# EAGLE design Zuino M UNO (EAGLE 8.4.1)
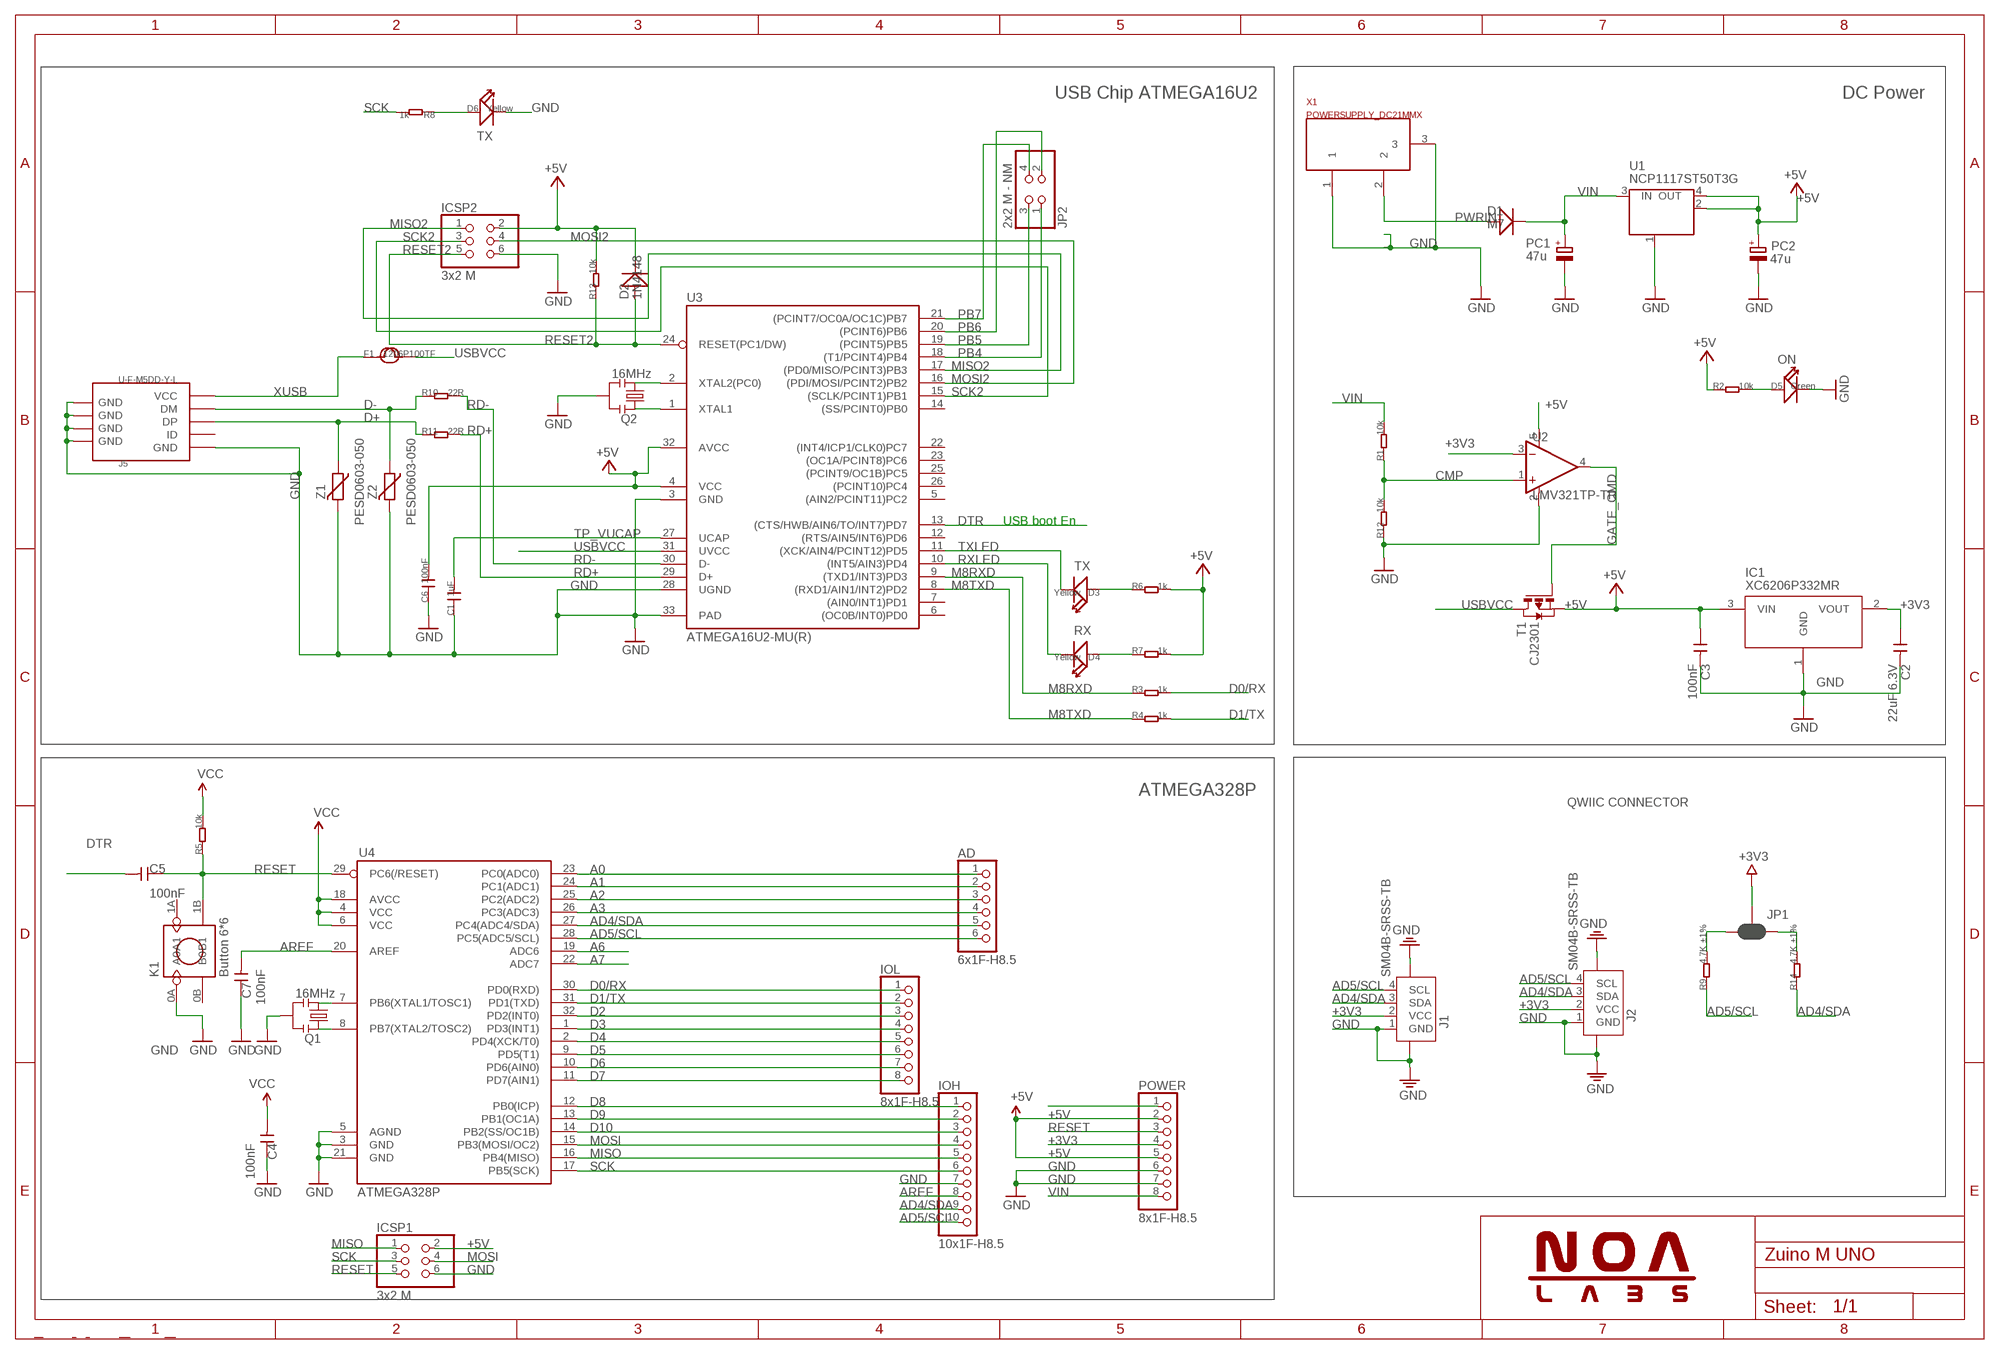
[diagram p0: schematic, sheet 1]

## Parts
AD  6x1F-H8.5  PINHD-1X6  [1X06]
C1  1uF  C-0603  [0603]
C2  22uF 6.3V  C-0603  [0603]
C3  100nF  C-0603  [0603]
C4  100nF  C-0603  [0603]
C5  100nF  C-0603  [0603]
C6  100nF  C-0603  [0603]
C7  100nF  C-0603  [0603]
D1  M7  D-B130L-13-F  [SMA]
D2  1N4148  D'1206'  [SOD123]
D3  Yellow  LED'0805'  [LED-0805]
D4  Yellow  LED'0805'  [LED-0805]
D5  Green  LED'0805'  [LED-0805]
D6  Yellow  LED'0805'  [LED-0805]
F1  1206P100TF  FUSE1206  [1206]
IC1  XC6206P332MR  XC6206MR  [SOT23]
ICSP1  3x2 M  PINHD-2X3  [2X03]
ICSP2  3x2 M  PINHD-2X3  [2X03]
IOH  10x1F-H8.5  PINHD-1X10_ARD  [1X10]
IOL  8x1F-H8.5  PINHD-1X8  [1X08]
J1  SM04B-SRSS-TB  JST-SH-4P-1.0  [JST-SH-4P]
J2  SM04B-SRSS-TB  JST-SH-4P-1.0  [JST-SH-4P]
J5  U-F-M5DD-Y-L  USB-MICROE  [MICRO-SMD]
JP1  JUMPER-SMT_3_2-NC_PASTE_SILK  [SMT-JUMPER_3_2-NC_PASTE_SILK]
JP2  2x2 M - NM  PINHD-2X2  [2X02]
K1  Button 6*6  BOTTON-4P-6X6  [4P-SMD-6X6]
PC1  47u  CPOL-EUD  [PANASONIC_D]
PC2  47u  CPOL-EUD  [PANASONIC_D]
POWER  8x1F-H8.5  PINHD-1X8  [1X08]
Q1  16MHz  RESONATORSMD  [RESONATOR-SMD]
Q2  16MHz  RESONATORSMD  [RESONATOR-SMD]
R1  10k  R-0603  [0603]
R2  10k  R-0603  [0603]
R3  1k  R-0603  [0603]
R4  1k  R-0603  [0603]
R5  10k  R-0603  [0603]
R6  1k  R-0603  [0603]
R7  1k  R-0603  [0603]
R8  1k  R-0603  [0603]
R9  4.7K ±1%  R-0603  [0603]
R10  22R  R-0603  [0603]
R11  22R  R-0603  [0603]
R12  10k  R-0603  [0603]
R13  10k  R-0603  [0603]
R14  4.7K ±1%  R-0603  [0603]
T1  CJ2301  PMOSSOT23  [SOT-23]
U1  NCP1117ST50T3G  MC33269ST-3.3T3  [SOT223]
U2  LMV321TP-TR  LM321  [SOT23-5]
U3  ATMEGA16U2-MU(R)  ATMEGA16U2-MU  [MLF32]
U4  ATMEGA328P  ATMEGA168  [TQFP32-08]
X1  POWERSUPPLY_DC21MMX  [POWERSUPPLY_DC-21MM]
Z1  PESD0603-050  VARISTORCN0603  [CT/CN0603]
Z2  PESD0603-050  VARISTORCN0603  [CT/CN0603]

## Nets
+3V3: C2.1 IC1.2(VOUT) J1.2(VCC) J2.2(VCC) JP1.2 POWER.4 U2.3(IN-)
+5V [usbvcc]: C3.1 C4.2 C6.2 D2.- IC1.3(VIN) ICSP1.2 ICSP2.2 PC2.+ POWER.2 POWER.5 R2.1 R5.2 R6.2 R7.2 R13.2 T1.2(S) U1.2(OUT) U1.4(OUT) U2.5(V+) U3.4(VCC) U3.32(AVCC) U4.4(VCC) U4.6(VCC) U4.18(AVCC) ; supply symbol labelled VCC
A0: AD.1 U4.23(PC0(ADC0))
A1: AD.2 U4.24(PC1(ADC1))
A2: AD.3 U4.25(PC2(ADC2))
A3: AD.4 U4.26(PC3(ADC3))
A6: U4.19(ADC6)
A7: U4.22(ADC7)
AD4/SDA: AD.5 IOH.9 J1.3(SDA) J2.3(SDA) R14.1 U4.27(PC4(ADC4/SDA))
AD5/SCL: AD.6 IOH.10 J1.4(SCL) J2.4(SCL) R9.1 U4.28(PC5(ADC5/SCL))
AREF [aref]: C7.2 IOH.8 U4.20(AREF)
CMP: R1.1 R12.2 U2.1(IN+)
D0/RX: IOL.1 R3.2 U4.30(PD0(RXD))
D1/TX: IOL.2 R4.2 U4.31(PD1(TXD))
D2: IOL.3 U4.32(PD2(INT0))
D3: IOL.4 U4.1(PD3(INT1))
D4: IOL.5 U4.2(PD4(XCK/T0))
D5: IOL.6 U4.9(PD5(T1))
D6: IOL.7 U4.10(PD6(AIN0))
D7: IOL.8 U4.11(PD7(AIN1))
D8: IOH.1 U4.12(PB0(ICP))
D9: IOH.2 U4.13(PB1(OC1A))
D10: IOH.3 U4.14(PB2(SS/OC1B))
D+: J5.D+(DP) R11.1 Z1.1
D-: J5.D-(DM) R10.1 Z2.1
DTR: C5.2 U3.13((CTS/HWB/AIN6/TO/INT7)PD7)
GATE_CMD: T1.3(G) U2.4(OUT)
GND [gnd]: C1.1 C2.2 C3.2 C4.1 C6.1 C7.1 D5.- D6.- IC1.1(GND) ICSP1.6 ICSP2.6 IOH.7 J1.1(GND) J1.NC1 J1.NC2 J2.1(GND) J2.NC1 J2.NC2 J5.GND J5.S1(GND) J5.S1@1(GND) J5.S1@2(GND) J5.S2(GND) J5.S2@1(GND) J5.S2@2(GND) J5.S3(GND) J5.S3@1(GND) J5.S3@2(GND) J5.S4(GND) J5.S4@1(GND) J5.S4@2(GND) K1.0A(A0) PC1.- PC2.- POWER.6 POWER.7 Q1.2 Q2.2 R12.1 U1.1(GND/ADJ) U2.2(V-) U3.3(GND) U3.28(UGND) U3.33(PAD) U4.3(GND) U4.5(AGND) U4.21(GND) X1.1 X1.3 Z1.2 Z2.2
M8RXD: R3.1 U3.9((TXD1/INT3)PD3)
M8TXD: R4.1 U3.8((RXD1/AIN1/INT2)PD2)
MISO: ICSP1.1 IOH.5 U4.16(PB4(MISO))
MISO2: ICSP2.1 U3.17((PD0/MISO/PCINT3)PB3)
MOSI: ICSP1.4 IOH.4 U4.15(PB3(MOSI/OC2))
MOSI2: ICSP2.4 U3.16((PDI/MOSI/PCINT2)PB2)
N$1: D6.+ R8.1
N$2: POWER.1
N$3: D5.+ R2.2
N$5: Q2.1 U3.1(XTAL1)
N$9: JP1.3 R9.2
N$10: JP1.1 R14.2
N$16: Q1.1 U4.8(PB7(XTAL2/TOSC2))
N$17: Q1.3 U4.7(PB6(XTAL1/TOSC1))
N$21: Q2.3 U3.2(XTAL2(PC0))
N$35: D4.+ R7.1
N$36: D3.+ R6.1
PB4: JP2.1 U3.18((T1/PCINT4)PB4)
PB5: JP2.3 U3.19((PCINT5)PB5)
PB6: JP2.2 U3.20((PCINT6)PB6)
PB7: JP2.4 U3.21((PCINT7/OC0A/OC1C)PB7)
PWRIN [power]: D1.P$2(+) X1.2
RD+: R11.2 U3.29(D+)
RD-: R10.2 U3.30(D-)
RESET: C5.1 ICSP1.5 K1.1B(B1) POWER.3 R5.1 U4.29(PC6(/RESET))
RESET2: D2.+ ICSP2.5 R13.1 U3.24(RESET(PC1/DW))
RXLED: D4.- U3.10((INT5/AIN3)PD4)
SCK: ICSP1.3 IOH.6 R8.2 U4.17(PB5(SCK))
SCK2: ICSP2.3 U3.15((SCLK/PCINT1)PB1)
TP_VUCAP: C1.2 U3.27(UCAP)
TXLED: D3.- U3.11((XCK/AIN4/PCINT12)PD5)
USBVCC [usbvcc]: F1.2 T1.1(D) U3.31(UVCC)
VIN [power]: D1.P$1(-) PC1.+ POWER.8 R1.2 U1.3(IN)
XUSB [usbvcc]: F1.1 J5.VBUS(VCC)
Unconnected: J5.ID K1.0B(B0) K1.1A(A1) U3.5((AIN2/PCINT11)PC2) U3.6((OC0B/INT0)PD0) U3.7((AIN0/INT1)PD1) U3.12((RTS/AIN5/INT6)PD6) U3.14((SS/PCINT0)PB0) U3.22((INT4/ICP1/CLK0)PC7) U3.23((OC1A/PCINT8)PC6) U3.25((PCINT9/OC1B)PC5) U3.26((PCINT10)PC4)

## Notes on the sheet
- USB Chip ATMEGA16U2 | DC Power
- TX
- ON
- USB boot En
- TX
- RX
- ATMEGA328P
- QWIIC CONNECTOR

## Library data of the parts
AD = SmartPrj:PINHD-1X6: PIN HEADER
C1-C7 = Discrete:C*: Ceramic Capacitors
D1 D2 = Discrete:D*
D3-D6 = Discrete:LED*
F1 = Discrete:FUSE
IC1 = IC:XC6206MR
ICSP1 ICSP2 = SmartPrj:PINHD-2X3: PIN HEADER
IOH = SmartPrj:PINHD-1X10_ARD: PIN HEADER
IOL POWER = SmartPrj:PINHD-1X8: PIN HEADER
J1 J2 = Connector:JST-SH-4P
J5 = Connector:USB-MICROE
JP1 = SparkFun-Jumpers:JUMPER-SMT_3_2-NC_PASTE: Normally closed solder jumper (2 of 2 connections) This jumper has an aperture in the stencil to allow solder paste to bridge both connections. Both connections are normally closed (NC). Wick off the solder to open the connection(s). Reapply solder to reclose the connection(s).
JP2 = SmartPrj:PINHD-2X2: PIN HEADER
K1 = Discrete:BOTTON-4P
PC1 PC2 = rcl:CPOL-EU: POLARIZED CAPACITOR, European symbol
Q1 Q2 = SparkFun:RESONATOR: Resonator Small SMD resonator. This is the itty bitty 10/20MHz resonators with built in caps. CSTCE10M0G55 and CSTCE20M0V53. Footprint has been reviewed closely but hasn't been tested yet.
R1-R8 R10-R13 = Discrete:R*
R9 R14 = Discretex:R*
T1 = zetex:PMOSSOT23: MOS FET
U1 = linear:MC33269ST*: Adjustable Output Low Dropout Voltage Regulator 800 mA Source: http://www.onsemi.com/pub/Collateral/MC33269-D.PDF
U2 = IC:LM321: Low Power Single Op Amp http://www.national.com/ds/LM/LM321.pdf
U3 = SmartPrj:ATMEGA16U2-
U4 = SparkFun:ATMEGA168
X1 = SmartPrj:POWERSUPPLY_DC21MM
Z1 Z2 = varistor:VARISTOR: VARISTOR

## Net classes
1 power: width 0.254 mm, drill 0.381 mm, clearance 0.178 mm
2 gnd: width 0.254 mm, drill 0.305 mm, clearance 0.178 mm
3 usbvcc: width 0.254 mm, drill 0.381 mm, clearance 0.178 mm
4 aref: width 0.254 mm, drill 0.381 mm, clearance 0.178 mm

## Board
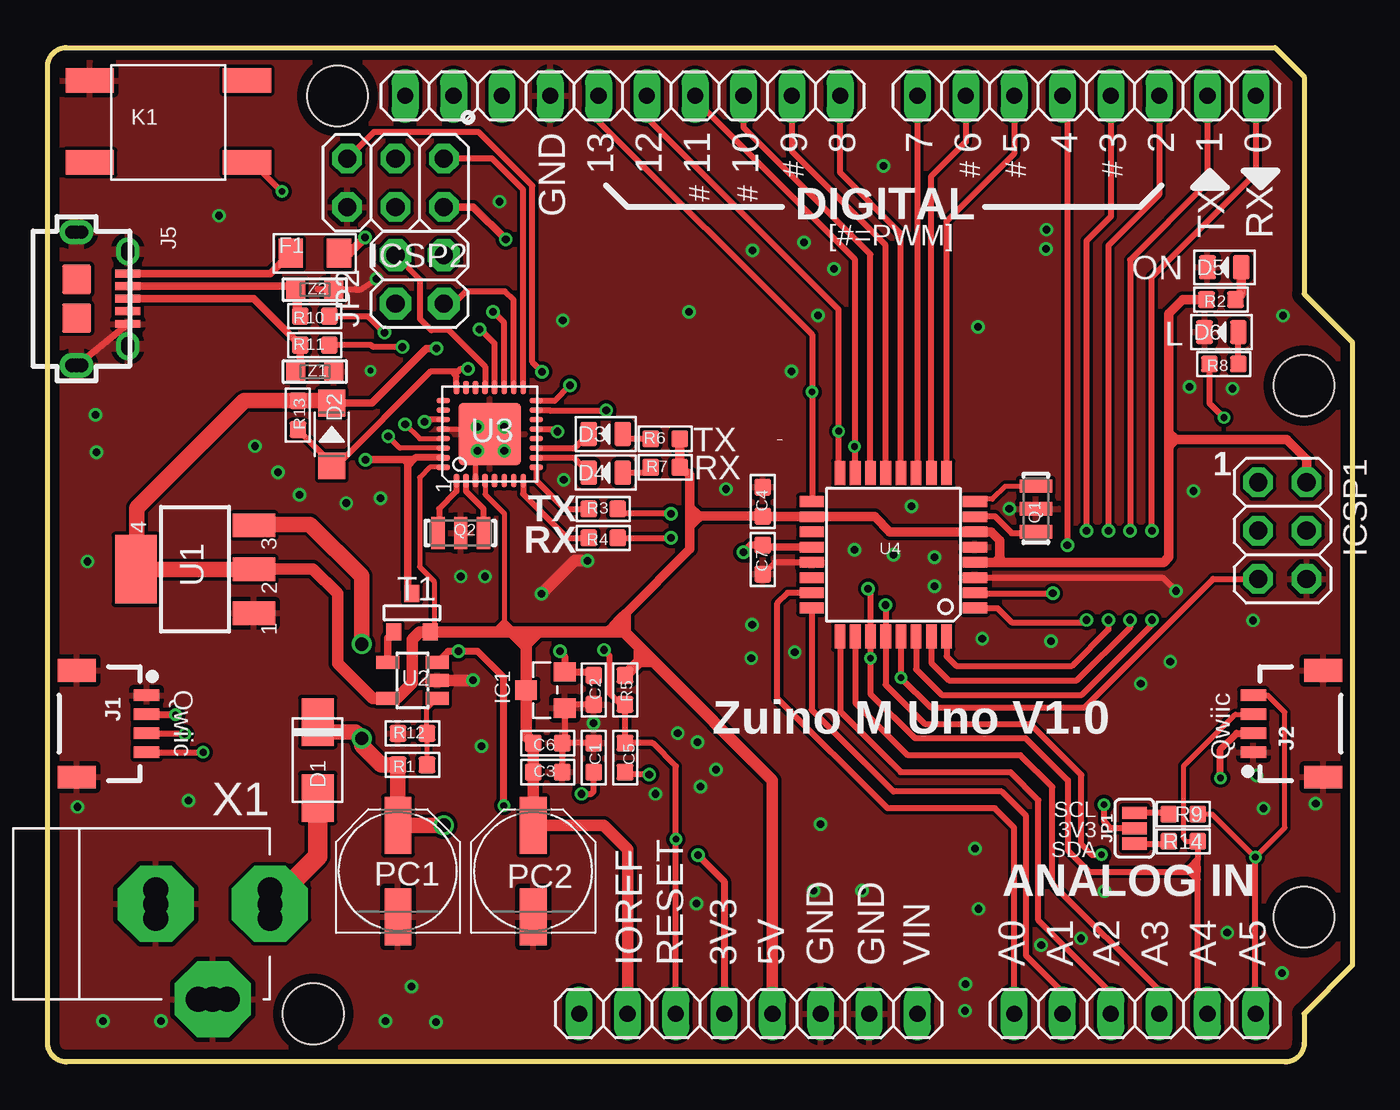
[diagram p1: board, top side]
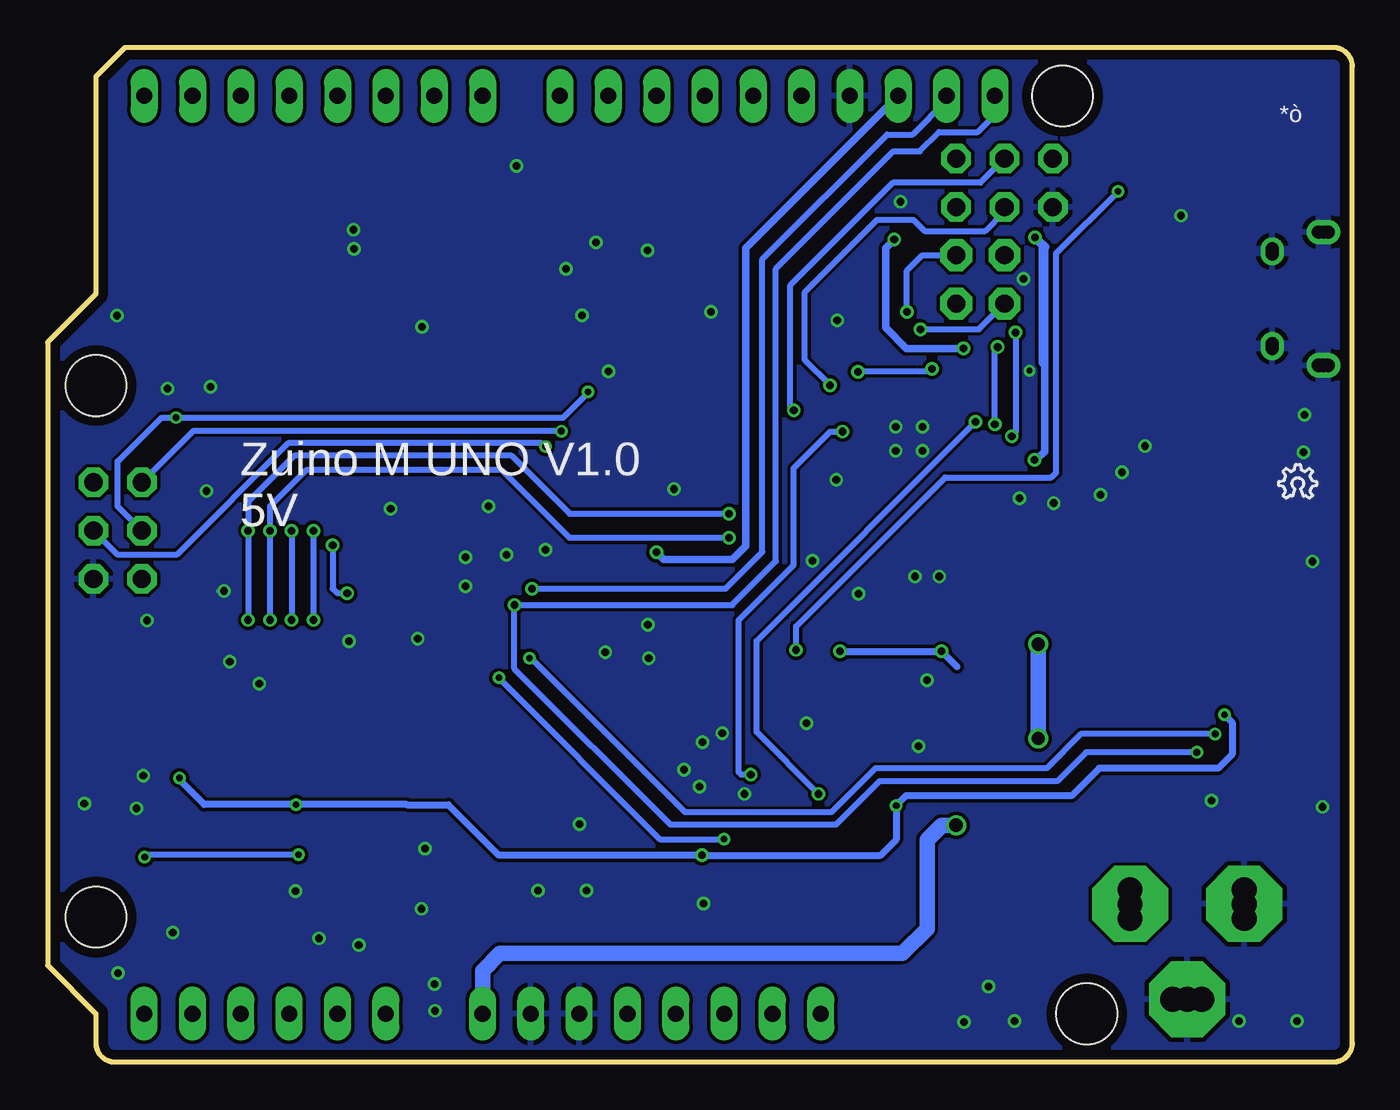
[diagram p2: board, bottom side, seen from below]

Size 68.58 x 53.34 mm. Coordinates in mm from the lower left corner, seen from the top.
Outline: 64.52,53.34 66.04,51.82 66.04,40.39 68.58,37.85 68.58,5.08 66.04,2.54 66.04,1 arc-90 65.04,0 1,0 arc-90 0,1 0,52.34 arc-90 1,53.34 64.52,53.34
Copper layers (1*16): Top 0.035mm / dielectric 1.5mm / Bottom 0.035mm
Design rules "NOA Eagle Rule": minimum track width 7mil, minimum drill 12mil, track to track 7mil, track to pad 7mil, pad to pad 7mil, via to via 7mil, smd to smd 0mil, copper to edge 20mil, drill to drill 10mil, minimum pad ring 10mil, minimum via ring 6mil, stop-mask expansion 2mil, vias tented up to drill 25mil, thermal gap 10mil
Holes 3.2 mm at 66.04,35.56 66.04,7.62 15.24,50.8 13.97,2.54

### Footprints (pad centres in the part's own frame; a part is rotated, then mirrored left to right if it is on the bottom)
1X06 = drill 0.85 pad 1.422 long: 1 -6.35,0; 2 -3.81,0; 3 -1.27,0; 4 1.27,0; 5 3.81,0; 6 6.35,0
0603 = smd 0.889 x 0.889: 1 -0.762,0; 2 0.762,0
SMA = smd 2.5 x 1.7: P$1 -2,0; P$2 2,0
SOD123 = smd 1.397 x 1.397: + 1.651,0; - -1.651,0
LED-0805 = smd 0.889 x 1.27: + -0.889,0; - 0.889,0
1206 = smd 1.27 x 1.524: 1 -1.27,0; 2 1.27,0
SOT23 = smd 1.016 x 1.143: 1 -0.95,-1.016; 2 0.95,-1.016; 3 0,1.016
2X03 = drill 0.95 pad 1.55 octagon: 1 -2.54,-1.27; 2 -2.54,1.27; 3 0,-1.27; 4 0,1.27; 5 2.54,-1.27; 6 2.54,1.27
1X10 = drill 0.85 pad 1.422 long: 1 -11.43,0; 2 -8.89,0; 3 -6.35,0; 4 -3.81,0; 5 -1.27,0; 6 1.27,0; 7 3.81,0; 8 6.35,0; 9 8.89,0; 10 11.43,0
1X08 = drill 0.85 pad 1.422 long: 1 -8.89,0; 2 -6.35,0; 3 -3.81,0; 4 -1.27,0; 5 1.27,0; 6 3.81,0; 7 6.35,0; 8 8.89,0
JST-SH-4P = smd 0.6 x 1.35: 1 1.5,0; 2 0.5,0; 3 -0.5,0; 4 -1.5,0 | smd 1.2 x 2: NC1 -2.8,3.675; NC2 2.8,3.675
MICRO-SMD = smd 0.406 x 1.346: D+ 0,2.057; D- -0.66,2.057; GND 1.321,2.057; ID 0.66,2.057; VBUS -1.321,2.057 | drill 0.7: S1 -2.489,2.057; S1@1 -2.616,2.057; S1@2 -2.362,2.057; S2 2.464,2.057; S2@1 2.362,2.057; S2@2 2.616,2.057 | drill 0.7 pad 1.27: S3 -3.505,-0.66; S3@1 -3.505,-0.381; S3@2 -3.505,-0.889; S4 3.505,-0.635; S4@1 3.505,-0.381; S4@2 3.505,-0.889 | smd 1.524 x 1.524: S5 -1.016,-0.635; S6 1.016,-0.635
SMT-JUMPER_3_2-NC_PASTE_SILK = smd 0.635 x 1.27: 1 -0.813,0; 2 0,0; 3 0.813,0
2X02 = drill 0.95 pad 1.676 octagon: 1 -1.27,-1.27; 2 -1.27,1.27; 3 1.27,-1.27; 4 1.27,1.27
4P-SMD-6X6 = smd 2.54 x 1.27: 0A -4.129,2.205; 0B 4.129,2.205; 1A -4.129,-2.105; 1B 4.129,-2.105
PANASONIC_D = smd 3 x 1.4: + 2.4,0; - -2.4,0
RESONATOR-SMD = smd 0.7 x 1.7: 1 -1.2,0; 2 0,0; 3 1.2,0
SOT-23 = smd 0.787 x 0.889: 1 0.025,-1.016; 2 -0.94,1.016; 3 0.991,1.016
SOT223 = smd 1.219 x 2.235: 1 -2.311,-3.099; 2 0,-3.099; 3 2.311,-3.099 | smd 3.6 x 2.2: 4 0,3.099
SOT23-5 = smd 0.69 x 1.2: 1 -0.95,-1.3; 2 0,-1.3; 3 0.95,-1.3; 4 0.95,1.3; 5 -0.95,1.3
MLF32 = smd 0.7 x 0.28: 1 -2.45,1.75; 2 -2.45,1.25; 3 -2.45,0.75; 4 -2.45,0.25; 5 -2.45,-0.25; 6 -2.45,-0.75; 7 -2.45,-1.25; 8 -2.45,-1.75; 17 2.45,-1.75; 18 2.45,-1.25; 19 2.45,-0.75; 20 2.45,-0.25; 21 2.45,0.25; 22 2.45,0.75; 23 2.45,1.25; 24 2.45,1.75 | smd 0.28 x 0.7: 9 -1.75,-2.45; 10 -1.25,-2.45; 11 -0.75,-2.45; 12 -0.25,-2.45; 13 0.25,-2.45; 14 0.75,-2.45; 15 1.25,-2.45; 16 1.75,-2.45; 25 1.75,2.45; 26 1.25,2.45; 27 0.75,2.45; 28 0.25,2.45; 29 -0.25,2.45; 30 -0.75,2.45; 31 -1.25,2.45; 32 -1.75,2.45 | smd 3.254 x 3.254: 33 0,0
TQFP32-08 = smd 1.27 x 0.559: 1 -4.293,2.8; 2 -4.293,2; 3 -4.293,1.2; 4 -4.293,0.4; 5 -4.293,-0.4; 6 -4.293,-1.2; 7 -4.293,-2; 8 -4.293,-2.8; 17 4.293,-2.8; 18 4.293,-2; 19 4.293,-1.2; 20 4.293,-0.4; 21 4.293,0.4; 22 4.293,1.2; 23 4.293,2; 24 4.293,2.8 | smd 0.559 x 1.27: 9 -2.8,-4.293; 10 -2,-4.293; 11 -1.2,-4.293; 12 -0.4,-4.293; 13 0.4,-4.293; 14 1.2,-4.293; 15 2,-4.293; 16 2.8,-4.293; 25 2.8,4.293; 26 2,4.293; 27 1.2,4.293; 28 0.4,4.293; 29 -0.4,4.293; 30 -1.2,4.293; 31 -2,4.293; 32 -2.8,4.293
POWERSUPPLY_DC-21MM = drill 1.3 pad 4 octagon: 1 -5.08,-3.353; 2 -0.076,-6.35; 3 -0.076,-0.356 | drill 1.3: 4 -5.08,-4.115; 5 -5.08,-2.591; 6 -0.838,-0.356; 7 0.686,-0.356; 8 -0.838,-6.35; 9 0.686,-6.35
CT/CN0603 = smd 1 x 1: 1 -1,0; 2 1,0

### Placement (x,y rotation side)
AD  57.15,2.54 0 top
C1  28.7,16 270 top
C2  28.7,19.56 270 top
C3  26.29,15.24 0 top
C4  37.59,29.46 270 top
C5  30.35,16 270 top
C6  26.29,16.76 180 top
C7  37.59,26.42 90 top
D1  14.2,15.88 270 top
D2  14.94,32.99 270 top
D3  29.34,33.02 180 top
D4  29.34,30.99 180 top
D5  61.85,41.78 180 top
D6  61.7,38.38 180 top
E$13  [12MM]  40.16,40.94 0 bottom
F1  14.05,42.52 0 top
IC1  26.16,19.56 90 top
ICSP1  64.9,27.94 270 top
ICSP2  18.29,46.23 180 top
IOH  30.23,50.8 180 top
IOL  54.61,50.8 180 top
J1  5.21,17.78 90 top
J2  63.37,17.78 270 top
J5  2.16,40.13 270 top
JP1  57.12,12.29 90 top
JP2  19.56,41.15 90 top
K1  6.35,49.4 0 top
LOGO1  LOGO-OSHW-6MILX0070-NT  [OSHW_6X70_NOTEXT]  3.86,29.64 0 bottom
PC1  18.41,10.03 90 top
PC2  25.53,10.03 90 top
POWER  36.83,2.54 0 top
Q1  51.94,29.08 270 top
Q2  21.72,27.81 0 top
R1  19.18,15.62 180 top
R2  61.67,40.08 0 top
R3  29.21,29.08 0 top
R4  29.21,27.56 0 top
R5  30.35,19.56 90 top
R6  32.46,32.77 0 top
R7  32.46,31.27 0 top
R8  61.82,36.7 180 top
R9  59.69,13.03 180 top
R10  14.05,39.22 0 top
R11  14.05,37.69 0 top
R12  19.18,17.27 0 top
R13  13.16,34.01 90 top
R14  59.69,11.61 180 top
T1  19.18,23.62 180 top
U1  7.75,25.91 90 top
U2  19.18,20.07 90 top
U3  23.24,33.02 90 top
U4  44.45,26.67 180 top
U$1  [10MM]  40.56,34.19 0 top
X1  5.33,8.38 90 top
Z1  14.05,36.3 0 top
Z2  14.05,40.61 0 top

### Tracks (layer width: path | path; a pad name or v marks a point on that pad's centre or on a via)
+3V3  (via drill 0.35, 0.4)
  Top 0.305: JP1.2 55.88,12.29 55.52,12.65 v55.52,13.54
  Top 0.381: v26.92,21.59 27.18,21.34 IC1.2 28.51,20.51 C2.1 | U2.3 21.05,21.59 v21.59,21.59 22.61,21.59 23.98,20.22 v23.98,13.49 | v34.19,10.87 35.56,9.5 POWER.4 | v61.65,14.94 61.65,16.43 62.49,17.28 J2.2 | J1.2 6.71,18.28 v6.73,18.26
  Bottom 0.381: v26.92,21.59 v21.59,21.59 20.78,20.78 | v61.65,14.94 61.65,14.83 60.35,13.54 v55.52,13.54 49.71,13.54 49.7,13.53 47.51,13.53 44.86,10.87 v34.19,10.87 24.79,10.87 23.98,11.68 v23.98,13.49 23.47,13.99 14.76,13.99 13.31,15.44 7.06,15.44 6.33,16.18 6.33,17.86 v6.73,18.26
+5V  (via drill 0.4)
  Top 0.254: U3.32 20.09,31.27 19.56,30.73 19.56,26.04 20.32,25.27 20.32,22.81 T1.2 | U3.4 22.99,29.84 24,28.83 24,23.16 | 24,23.16 24,22.73 23.88,22.61 | 24,23.16 23.44,22.61 | 24,23.16 24.56,22.61
  Top 0.305: 49.66,26.27 49.69,26.27 50.04,26.62 50.39,26.27 50.52,26.27
  Top 0.406: v20.45,37.52 19.91,37.52 17.04,34.65 D2.- | v24.08,43.26 22.38,44.96 ICSP2.2
  Top 0.508: R6.2 R7.2 33.76,30.89 33.76,29.16 | U4.4 49.66,26.27 50.04,26.27 | 50.04,26.27 50.52,26.27 58.66,26.27 58.93,26.54 58.93,32.44 | 50.04,26.27 50.04,26.62 50.04,27.43 49.6,27.87 U4.6 44.27,27.87 43.47,28.67 U4.18 37.62,28.67 C4.2 34.19,28.7 | 33.76,29.16 33.76,28.63 | 33.76,28.17 33.76,28.63 | 33.76,28.17 33.76,26.98 30.4,23.62 | 30.4,23.62 30.12,23.34 | 30.4,23.62 30.4,22.71 30.3,22.61 | 30.12,23.34 30.12,22.89 29.84,22.61 | 30.12,23.34 29.72,22.94 29.72,22.91 | 29.72,22.91 29.72,22.61 | 29.72,22.91 29.41,22.61 | 58.93,32.72 58.93,33.07 | 58.93,32.44 58.93,32.72 | 58.93,32.72 59.28,32.72 | 59.28,32.72 65.13,32.72 66.17,31.67 ICSP1.2 | 59.28,32.72 58.93,33.07 | 59.28,32.72 59,32.44 58.93,32.44 | 33.76,28.63 33.83,28.7 34.19,28.7 | 34.19,28.7 34.19,28.73 33.76,29.16 | 34.19,28.7 34.19,28.6 33.76,28.17 | R2.1 59.66,40.08 58.93,39.34 58.93,33.07
  Top 0.61: 25.15,21.84 IC1.3 25.15,17.14 C6.2 C3.1 PC2.+ 29.22,12.43 30.48,11.18 POWER.2 | 24.38,22.61 25.15,21.84 | 24.38,22.61 23.88,22.61 23.44,22.61 T1.2 19.56,22.61 19.18,22.23 19.18,19.94 18.35,19.12 U2.5 17.08,19.12 15.24,20.95 15.24,24.64 13.95,25.93 10.87,25.93 U1.2 | 25.15,21.84 25.15,21.97 25.78,22.61 | 25.78,22.61 29.41,22.61 29.72,22.61 29.84,22.61 30.3,22.61 31.23,21.68 | POWER.5 38.1,14.81 31.93,20.98 | 25.78,22.61 24.56,22.61 24.38,22.61 | 31.23,21.68 31.51,21.4 | 31.93,20.98 31.51,21.4 | R5.2 31.1,21.07 | 31.1,21.07 31.43,21.4 31.51,21.4 | 31.1,21.07 31.84,21.07 31.93,20.98 | 31.1,21.07 31.1,21.55 31.23,21.68
  Top 0.813: 13.13,34.75 R13.2 | R13.2 10.34,34.77 4.7,29.13 4.7,25.96 U1.4 U1.2 | R13.2 14.81,34.77 D2.-
  Bottom 0.406: v20.45,37.52 23.44,37.52 24.54,38.61 24.54,42.8 v24.08,43.26
A0
  Top 0.305: U4.23 38.89,24.67 38.35,24.13 38.35,19.13 44.15,13.34 49.78,13.34 50.8,12.32 AD.1
A1
  Top 0.305: U4.24 40.16,18.52 44.45,14.22 50.14,14.22 51.44,12.93 51.44,5.59 53.34,3.68 AD.2
A2
  Top 0.305: U4.25 41.65,18.42 44.83,15.24 50.6,15.24 52.07,13.77 52.07,7.44 55.85,3.66 55.85,2.56 AD.3
A3
  Top 0.305: U4.26 42.45,18.89 45.21,16.13 51.13,16.13 52.81,14.45 52.81,9.37 58.42,3.76 AD.4
AD4/SDA  (via drill 0.35, 0.4)
  Top 0.254: R14.1 59.84,11.61 59.7,11.75 59.7,15.56 62.42,18.28 J2.3
  Top 0.305: v43.13,24.89 43.25,24.77 U4.27 v43.25,21.23 43.25,19.36 45.59,17.02 51.41,17.02 53.62,14.81 53.62,11.12 54.74,10.01 59.79,10.01 | 60.45,10.67 60.02,10.24 | 59.89,10.11 59.79,10.01 | 60.45,9.6 60.45,10.01 | 60.45,9.6 60.45,3.05 AD.5 | 60.45,10.24 60.45,10.01 | 60.45,10.24 60.45,10.67 | 59.79,10.01 60.45,10.01 | 59.89,10.11 60.02,10.24 | 60.02,10.24 60.45,10.24 | 59.89,10.11 60.4,9.6 60.45,9.6 | R14.1 60.45,10.67 | J1.3 7.18,17.28 v7.21,17.25
  Bottom 0.305: v43.13,24.89 32.94,24.89 31.01,26.82 31.01,42.22 24.46,48.77 23.11,48.77 21.34,50.55 IOH.9 | v7.21,17.25 14.28,17.25 16.08,15.44 25.07,15.44 27.38,13.13 35.08,13.13 42.98,21.03 | 42.98,21.03 43.08,21.13 | v43.25,21.23 43.18,21.23 42.98,21.03
AD5/SCL  (via drill 0.35, 0.4)
  Top 0.254: 60.55,13.03 61.21,13.03 v63.48,10.77 65.02,12.32 65.02,18.39 64.13,19.28 J2.4
  Top 0.305: 44.05,23.75 U4.28 44.05,19.83 46.1,17.78 51.64,17.78 54.33,15.09 54.33,11.43 54.86,10.9 v55.4,10.9 | 44.05,23.75 44.05,24.05 | v44.04,24.03 44.04,23.75 44.05,23.75 | 63.5,2.77 AD.6 63.48,2.56 v63.48,10.77 | R9.1 60.55,13.03 | J1.4 v8.18,16.28
  Bottom 0.305: IOH.10 18.8,49.78 19.68,48.9 21.72,48.9 22.73,47.88 24.13,47.88 30.3,41.71 30.3,26.34 32.59,24.05 32.59,24.03 v44.04,24.03 44.04,20.68 35.84,12.47 27.15,12.47 24.87,14.76 15.52,14.76 13.99,16.28 v8.18,16.28 | v63.48,10.77 63.35,10.9 v55.4,10.9
AREF  (via drill 0.4)
  Top 0.406: 38.3,27.07 U4.20 | 38.3,27.07 37.48,27.07 37.47,27.05 | v36.58,26.8 36.96,27.18 C7.2 37.7,27.07 38.3,27.07
  Bottom 0.406: v36.58,26.8 36.2,26.42 32.59,26.42 31.88,27.13 31.88,42.8 IOH.8
CMP
  Top 0.254: R1.1 R12.2 19.94,18.58 U2.1
D0/RX  (via drill 0.4)
  Top 0.305: U4.30 45.65,20.64 46.99,19.3 54.36,19.3 58.04,22.99 v58.04,23.24 | v32.77,28.83 30.23,28.83 R3.2 | v58.04,27.94 58.04,41.27 63.5,46.74 IOL.1
  Bottom 0.305: v32.77,28.83 41.15,28.83 44.2,31.88 55.63,31.88 58.04,29.46 v58.04,27.94 v58.04,23.24
D1/TX  (via drill 0.4)
  Top 0.305: U4.31 46.45,20.99 47.37,20.07 54.1,20.07 56.9,22.86 v56.9,23.24 | R4.2 v32.77,27.56 | v56.9,27.94 56.9,42.16 60.96,46.23 IOL.2
  Bottom 0.305: v32.77,27.56 41.15,27.56 44.7,31.11 54.99,31.11 56.9,29.21 v56.9,27.94 v56.9,23.24
D2  (via drill 0.4)
  Top 0.305: U4.32 47.25,21.33 47.75,20.83 53.85,20.83 55.75,22.73 v55.75,23.24 | v55.75,27.94 55.75,42.93 58.42,45.59 IOL.3
  Bottom 0.305: v55.75,27.94 v55.75,23.24
D3  (via drill 0.4)
  Top 0.305: U4.1 49.92,23.87 50.67,23.11 54.48,23.11 v54.61,23.24 | v54.61,27.94 54.61,43.18 55.88,44.45 IOL.4
  Bottom 0.305: v54.61,27.94 v54.61,23.24
D4  (via drill 0.4)
  Top 0.305: U4.2 48.77,24.64 v52.83,24.64 | IOL.5 53.59,50.55 v53.59,27.18
  Bottom 0.305: v53.59,27.18 53.59,24.89 53.34,24.64 v52.83,24.64
D5
  Top 0.305: U4.9 47.25,44.2 50.8,47.75 IOL.6
D6
  Top 0.305: U4.10 46.45,46.58 48.26,48.39 IOL.7
D7
  Top 0.305: U4.11 45.72,31.03 IOL.8
D8
  Top 0.305: U4.12 44.85,43.57 41.66,46.76 IOH.1
D9
  Top 0.305: U4.13 44.05,42.95 39.12,47.88 IOH.2
D10
  Top 0.305: U4.14 43.25,42.48 36.58,49.15 IOH.3
D+
  Top 0.406: Z1.1 13.28,36.53 R11.1 10.85,40.13 J5.D+
D-
  Top 0.406: 13.27,39.23 R10.1 | 13.06,39.24 13.16,39.34 | J5.D- 12.87,40.79 Z2.1
  Top 0.508: R10.1 13.16,39.34 13.12,39.38 13.12,40.41 Z2.1
DTR  (via drill 0.4)
  Top 0.305: U3.13 26.67,33.27 v26.8,33.15 | v31.62,15.11 30.48,15.11 C5.2
  Bottom 0.305: v31.62,15.11 32.13,15.11 32.26,15.24 32.26,23.24 29.38,26.12 29.38,31.23 27.46,33.15 v26.8,33.15
GATE_CMD
  Top 0.406: U2.4 17.88,22.3 T1.3
GND  (via drill 0.3, 0.4)
  Top 0.254: 22.49,32.65 22.61,32.77 | U3.3 22.49,32.02 | U3.28 22.48,33.27
  Top 0.305: U4.3 58.6,25.47 v59.31,24.77 | U4.21 38.21,26.27 C7.1 | C6.1 27.18,16.89 IC1.1 27.37,18.8 C2.2 | C1.1 C6.1 | C6.1 C3.2 | 22.49,32.02 v22.61,32.13 22.61,32.54 22.49,32.65 | 22.48,33.27 v22.61,33.4 | v17.3,41.17 16.43,40.62 16.18,40.62 16.15,40.64 14.2,40.64 14.22,40.62 Z2.2
  Top 0.406: J5.GND J5.S4
  Top 0.61: U2.2 v22.35,20.07 | v25.96,24.61 27.71,26.36 v28.37,26.36
  Bottom 0.305: v59.31,24.77 59.56,24.77
  other vias: 49.12,22.25 13.23,29.82 2.51,34.04 40.26,9.02 42.8,9.02 2.92,2.16 5.97,2.16 24,33.4 24,32.13 46.61,26.54 46.61,25.02 42.42,26.92 44.45,26.67 52.48,42.75 52.5,43.76 48.9,38.66 50.55,29.08 21.72,25.53 22.99,25.53 17.75,2.16 20.42,2.11 19.13,3.96 17.5,29.64 10.9,32.38 15.7,29.39 2.57,32.05 12.12,31.01 1.57,13.41 7.42,13.74 2.11,26.31 55.55,8.99 52.73,22.12 16.97,36.35 28.7,17.81 62,6.81 33.12,17.3 34.16,16.81 34.32,14.48 48.21,2.69 52.22,6.15 54.31,6.5 48.92,8.05 48.23,4.09 48.74,11.23 34.11,8.33 23.75,45.24 64.87,4.67 66.65,13.59 63.55,15.06 63.35,23.22 59,21.06 64.92,39.24 39.75,43.1 33.71,39.45 39.09,36.32 9.02,44.5 22.81,16.61 31.95,14.1 39.27,21.54 27.08,38.99 35.66,30.12 35.13,15.37 37.03,22.99 36.98,21.23 27.13,30.61 43.94,47.12 45.42,29.21 40.61,12.5 57.45,19.89 63.91,13.34 60.22,30.02 41.33,41.71 37.06,42.67 40.49,39.27 60.02,35.51 62.28,35.41
  pour Top: 0.13,53.34 68.83,53.34 68.83,0.13 0.13,0.13
  pour Bottom: 0.13,53.34 68.83,53.34 68.83,0.38 0.13,0.13
M8RXD
  Top 0.305: U3.9 25.69,30.57 27.18,29.08 R3.1
M8TXD
  Top 0.305: U3.8 24.99,29.87 27.3,27.56 R4.1
MISO  (via drill 0.35)
  Top 0.305: 31.5,50.65 31.5,49.68 | 31.5,50.65 IOH.5 | U4.16 41.58,31.03 v41.58,33.17 41.58,39.57 31.5,49.66 31.5,50.65
  Bottom 0.305: v41.58,33.17 41.6,33.2 60.91,33.2 ICSP1.1
MISO2
  Top 0.305: ICSP2.1 23.37,47.5 24.99,45.88 U3.17
MOSI  (via drill 0.35)
  Top 0.305: IOH.4 34.04,50.6 42.42,42.22 v42.42,32.36 42.45,32.33 U4.15
  Bottom 0.305: v42.42,32.36 42.6,32.54 55.93,32.54 61.77,26.7 64.92,26.7 ICSP1.4
MOSI2  (via drill 0.4)
  Top 0.305: U3.16 26.64,34.77 v27.46,35.59
  Bottom 0.305: v27.46,35.59 28.78,36.91 28.78,40.49 24.98,44.28 23.08,44.28 22.48,43.69 19.3,43.69 18.29,44.7 ICSP2.4
N$1
  Top 0.305: R8.1 D6.+
N$3
  Top 0.305: D5.+ 62.61,41.66 | 62.61,39.93 R2.2
  Top 0.508: R2.2 62.74,40.39 D5.+
N$5
  Top 0.305: U3.1 21.49,30 20.57,29.08 20.57,27.87 Q2.1
N$9
  Top 0.305: R9.2 58.85,13.11 JP1.3
N$10
  Top 0.305: JP1.1 58.8,11.48 R14.2
N$16
  Top 0.254: U4.8 48.86,29.59 49.66,29.59 50.35,30.28 Q1.1
  Top 0.305: U4.8
N$17
  Top 0.305: U4.7 48.77,28.7 49.78,28.7 50.67,27.81 51.87,27.81 Q1.3
N$21
  Top 0.305: Q2.3 22.92,29.08 22,30 | 22,30 22,30.31 | U3.2 21.99,30 22,30
N$35
  Top 0.305: D4.+ 31.62,30.99 R7.1
N$36
  Top 0.305: R6.1 30.48,32.77 D3.+
PB4
  Top 0.305: U3.18 24.49,40.08 24.05,40.51 21.97,40.51 21.34,39.88 JP2.1
PB5  (via drill 0.4)
  Top 0.305: U3.19 23.99,38.87 v23.42,39.45
  Bottom 0.305: v23.42,39.45 23.42,41.6 22.61,42.42 JP2.3
PB6  (via drill 0.4)
  Top 0.305: U3.20 23.49,37.77 22.73,38.53 v22.71,38.53
  Bottom 0.305: v22.71,38.53 19.63,38.53 JP2.2
PB7
  Top 0.305: U3.21 22.99,36.57 21.08,38.48 20.17,38.48 19.58,39.06 19.58,41.12 JP2.4
PWRIN
  Top 1.016: D1.P$2 14.2,14.35 14.28,14.43 14.28,13.95 D1.P$2 | X1.2 14.2,10.82 D1.P$2
RD+  (via drill 0.4)
  Top 0.254: v18.8,33.53 19.55,32.77 U3.29
  Top 0.305: 14.94,37.82 R11.2 17.02,37.69 17.12,37.59 v18.64,37.59
  Bottom 0.305: v18.64,37.59 18.8,37.44 v18.8,33.53
RD-  (via drill 0.4)
  Top 0.254: v17.91,32.89 18.52,32.28 U3.30 | U3.30 | U3.30
  Top 0.305: R10.2 16.84,39.22 v17.7,38.35
  Bottom 0.254: v17.91,32.89 17.78,33.02
  Bottom 0.305: 17.83,32.97 v17.91,32.89 17.7,33.1 v17.7,38.35
RESET  (via drill 0.35, 0.4)
  Top 0.305: v29.23,21.67 29.54,21.36 29.54,19.38 30.12,18.8 R5.1 C5.1 31.8,16.76 33.02,15.54 v33.02,11.71 POWER.3 | v12.32,45.77 10.79,47.3 K1.1B | ICSP1.5 61.27,25.4 54.51,18.64 46.41,18.64 v44.85,20.2 U4.29
  Bottom 0.305: v29.23,21.67 29.23,22.91 21.41,30.73 15.82,30.73 15.57,30.99 15.57,42.52 v12.32,45.77 | v44.85,20.2 44.85,20.16 36.4,11.71 v33.02,11.71
RESET2  (via drill 0.4)
  Top 0.305: 21.21,36.32 21.49,36.04 U3.24 21.49,36.22 21.59,36.32 | 15.06,31.6 D2.+ | v22.1,36.45 21.72,36.45 21.59,36.32 | 15.34,31.34 15.16,31.34 | 15.16,31.34 D2.+ | D2.+ 14.94,31.47 R13.1 | ICSP2.5 17.14,48.9 22.65,48.9 22.93,48.61 | 15.16,31.34 20.14,36.32 21.21,36.32 | 21.21,36.32 21.59,36.32 | v25.98,36.3 25.47,36.81 25.47,46.08 22.93,48.61 | 22.71,48.84 22.93,48.61
  Top 0.61: 15.06,31.6 14.81,31.6
  Bottom 0.305: v22.1,36.45 22.25,36.3 v25.98,36.3
RXLED
  Top 0.305: U3.10 27.67,31.77 D4.-
SCK  (via drill 0.35)
  Top 0.305: IOH.6 28.98,50.77 28.98,49.45 40.18,38.25 v40.18,35.23 40.18,29.5 U4.17 40.26,29.57 40.18,29.65 | R8.2 61.06,34.65 v61.82,33.88
  Bottom 0.305: ICSP1.3 64.9,29.21 64.9,31.57 62.59,33.88 v61.82,33.88 41.48,33.88 40.18,35.18 v40.18,35.23
SCK2  (via drill 0.4)
  Top 0.305: U3.15 26.4,34.27 v29.36,34.27
  Bottom 0.305: v29.36,34.27 29.54,34.44 29.54,40.84 24.16,46.23 19.56,46.23 ICSP2.3
TP_VUCAP  (via drill 0.4)
  Top 0.305: U3.27 19.93,33.77 v19.81,33.66 | v28.07,14.1 28.57,14.1 28.7,14.22 C1.2
  Bottom 0.305: v28.07,14.1 31.32,17.35 31.32,22.15 v19.81,33.66
TXLED
  Top 0.305: U3.11 27.7,32.27 D3.-
USBVCC  (via drill 0.4)
  Top 0.356: U3.31 19.32,31.77 19.25,31.69
  Top 0.406: 18.92,31.37 18.92,24.87 T1.1 | 16.61,43.28 v16.69,43.36 | 15.85,42.52 F1.2 | 18.92,31.37 19.25,31.69 19.23,31.67 18.75,31.67 | 18.75,31.67 v16.71,31.67 | 18.92,31.37 18.92,31.5 18.75,31.67
  Top 0.508: v16.69,43.36 15.85,42.52
  Bottom 0.406: v16.71,31.67 16.61,31.67 16.18,32.11 16.18,42.85
  Bottom 0.508: 16.24,36.77 16.24,42.62 16.25,42.69 16.25,42.73 16.25,42.92 v16.69,43.36 16.18,42.85
VIN  (via drill 0.7)
  Top 0.813: v20.83,12.45 20.82,12.43 PC1.+ R1.2 17.53,15.62 16.51,16.64 v16.51,17.02 16.18,17.35 14.72,17.35 D1.P$1 | U1.3 10.9,28.27 13.79,28.27 16.51,25.55 v16.51,21.97
  Bottom 0.813: v20.83,12.45 21.59,12.45 22.35,11.68 22.35,7.01 23.65,5.71 44.81,5.71 45.72,4.8 POWER.8 | v16.51,17.02 v16.51,21.97
XUSB
  Top 0.406: F1.1 11.71,41.45 J5.VBUS

### Text on the board
tPlace: GND | 13 | 12 | 11 | 10 | 9 | 8 | 7 | 6 | 5 | 4 | 3 | 2 | 1 | 0 | # | # | # | # | # | # | DIGITAL | [#=PWM] | TX | RX | ON | L | TX | RX | Qwiic | Zuino M Uno V1.0 | Qwiic | SCL | 3V3 | SDA | ANALOG IN | IOREF | RESET | 3V3 | 5V | GND | GND | VIN | A0 | A1 | A2 | A3 | A4 | A5
bPlace: *ò | Zuino M UNO V1.0 / 5V
tNames: Z2 | Z1 | 1 | TX | RX | PC1 | PC2
214bmp: D:/SmartProjects/Snc/a4_bn_logo2.bmp